# EAGLE board scooter (EAGLE 4.11)
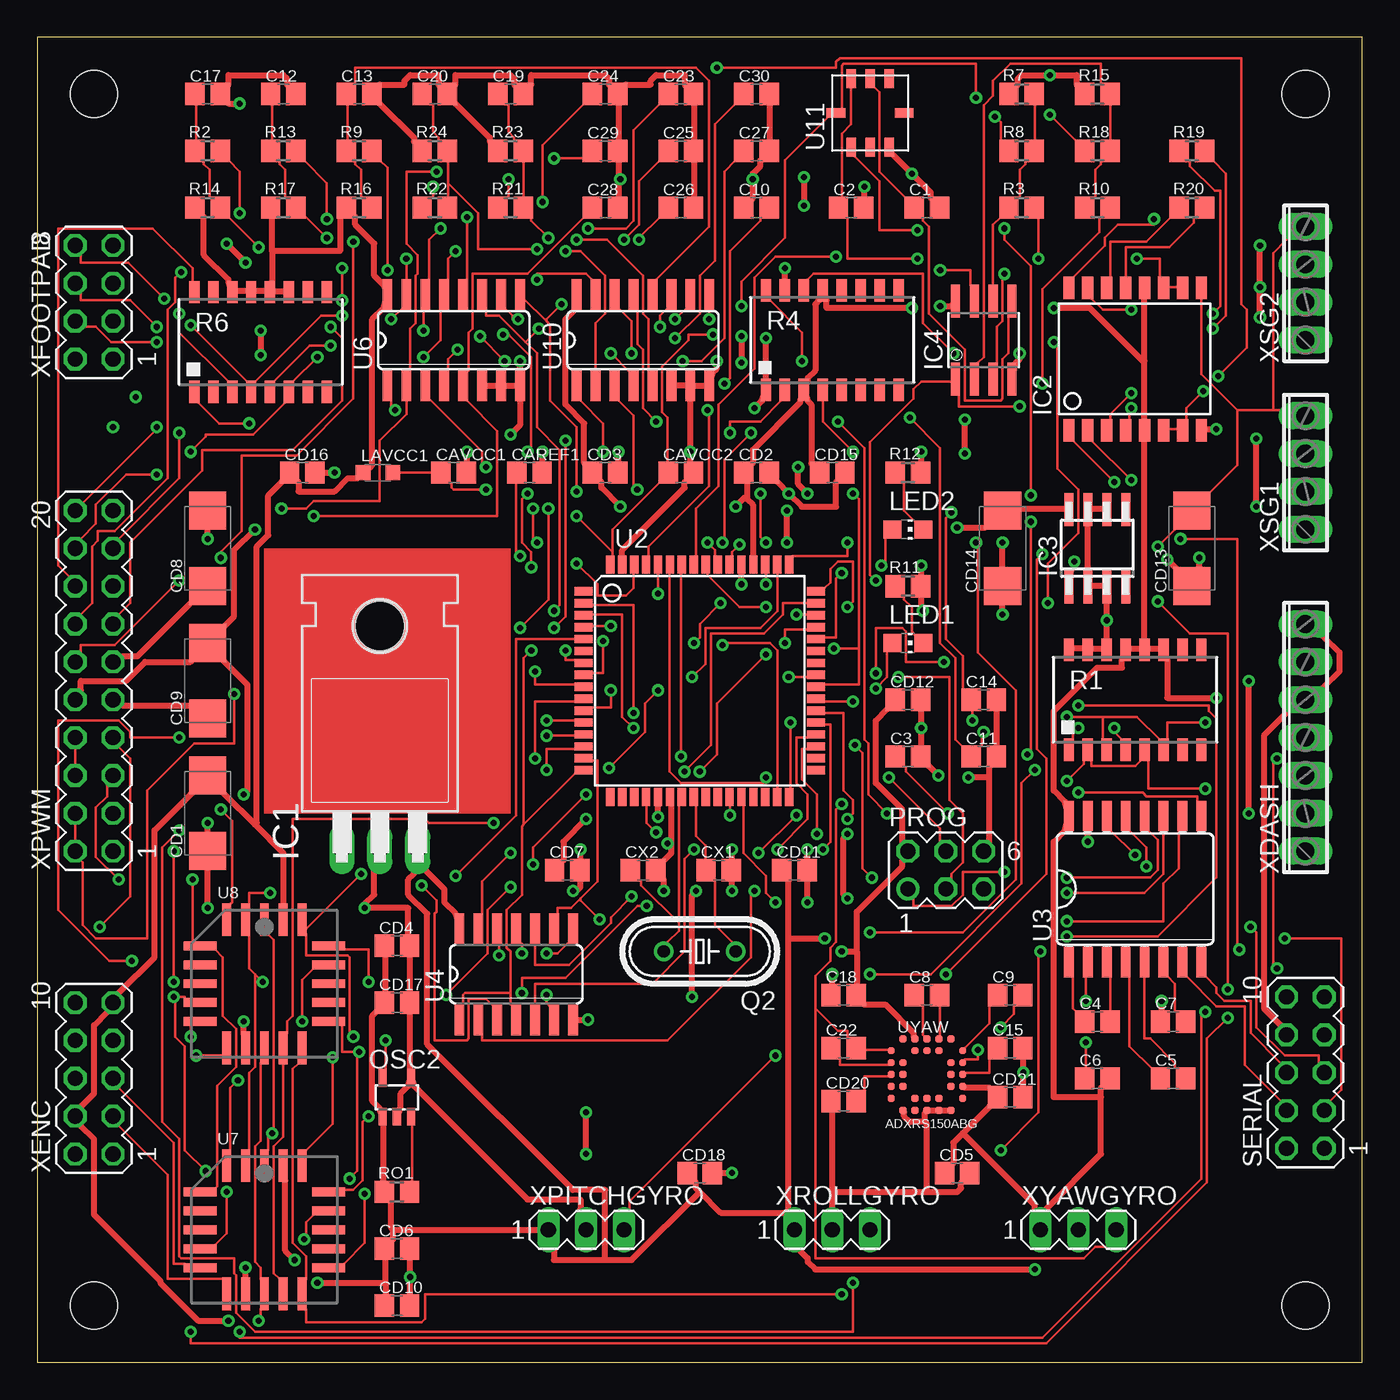
[diagram p5: board, top side]
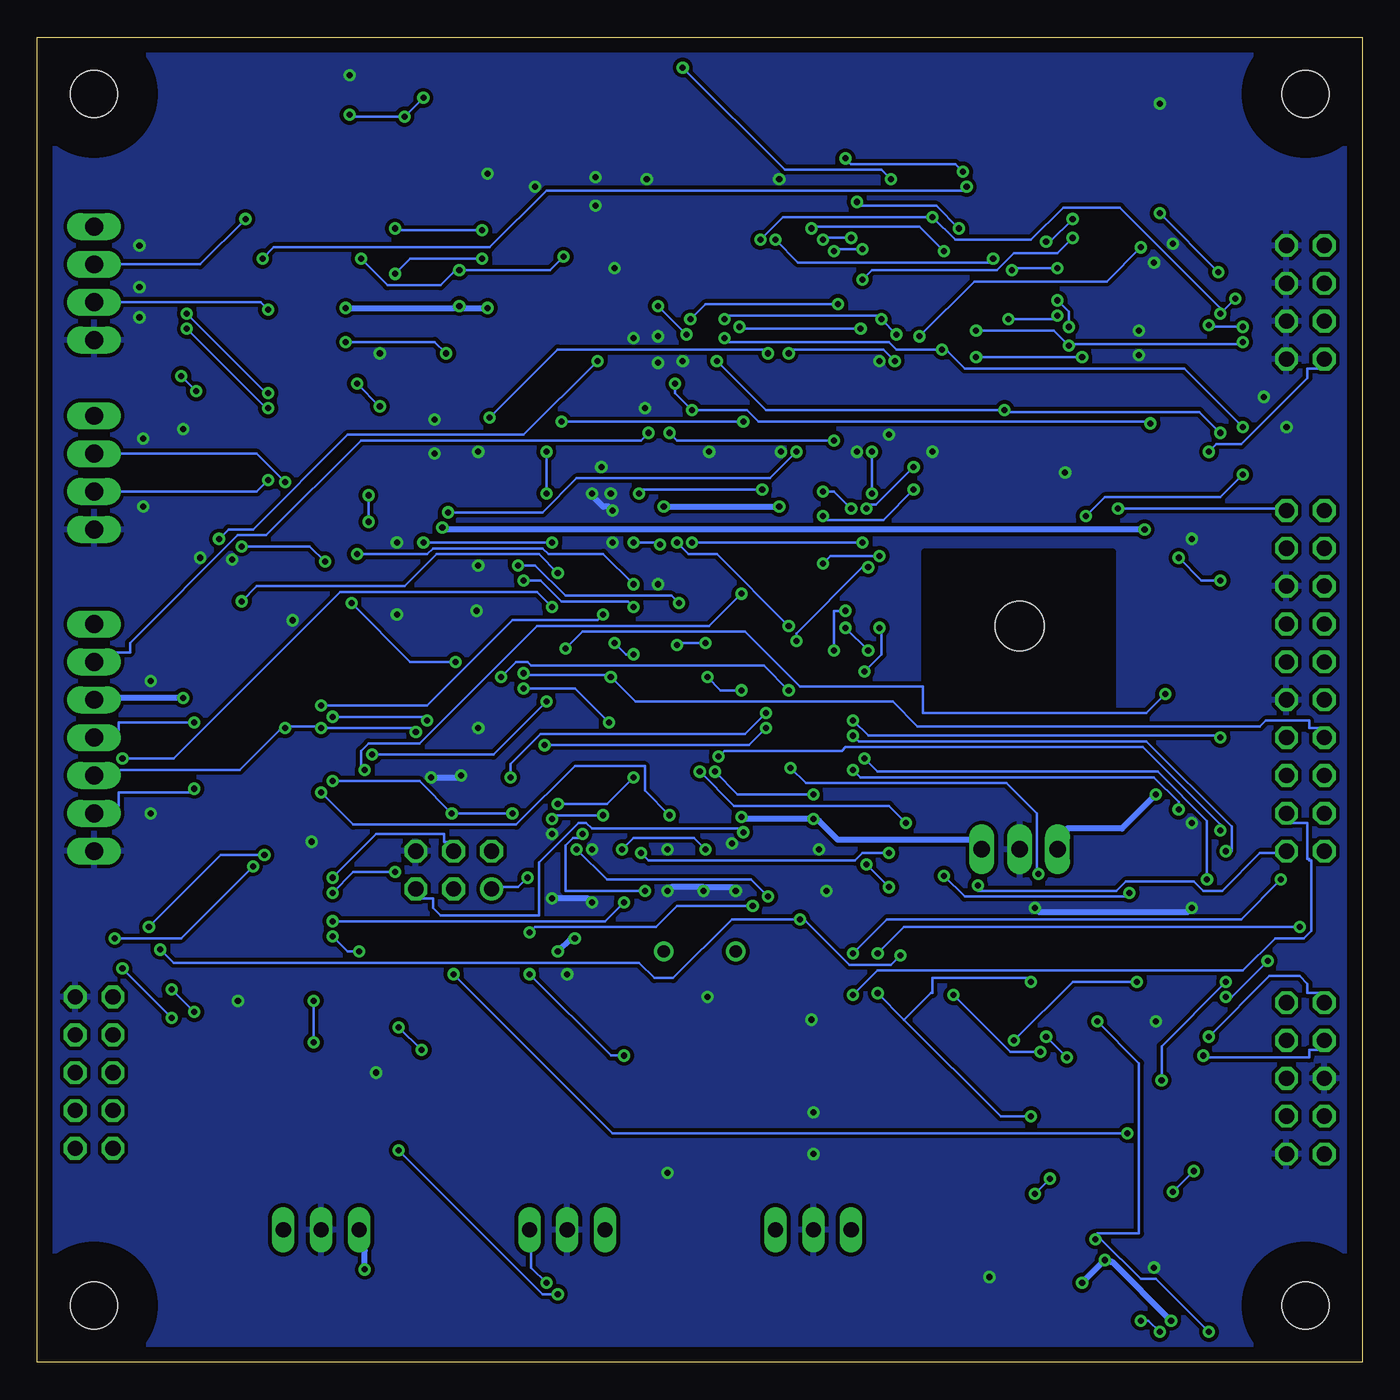
[diagram p6: board, bottom side, seen from below]

Size 88.9 x 88.9 mm. Coordinates in mm from the lower left corner, seen from the top.
Outline: 0,0 88.9,0 88.9,88.9 0,88.9 0,0
Copper layers (1*16): Top 0.035mm / dielectric 1.5mm / Bottom 0.035mm
Design rules "default": minimum track width 7mil, minimum drill 16mil, track to track 8mil, track to pad 8mil, pad to pad 8mil, via to via 8mil, smd to smd 8mil, copper to edge 40mil, drill to drill 8mil, minimum pad ring 10mil, minimum via ring 8mil, stop-mask expansion 4mil, vias tented up to drill 0mil, thermal gap 10mil
Net classes: 1 pwr: width 0.406 mm; 2 bigpwr: width 0.914 mm, clearance 0.813 mm; 3 ugpwr: width 0.61 mm, clearance 0.61 mm
Holes 3.17 mm at 3.81,85.09 85.09,3.81 3.81,3.81 85.09,85.09
tRestrict: area 0,81.3 to 7.6,88.9; area 81.3,81.3 to 88.9,88.9; area 81.3,0 to 88.9,7.6; area 0,0 to 7.6,7.6
bRestrict: area 16.8,43.7 to 29.3,54.4; area 0,81.3 to 7.6,88.9; area 81.3,81.3 to 88.9,88.9; area 81.3,0 to 88.9,7.6; area 0,0 to 7.6,7.6

## Footprints (pad centres in the part's own frame; a part is rotated, then mirrored left to right if it is on the bottom)
C0805 = smd 1.3 x 1.5: 1 -0.85,0; 2 0.85,0
C/6032-28R = smd 2.55 x 2.5: + 2.525,0; - -2.525,0
TO220H = drill 1.118 long: 1 -2.54,-10.16; 2 0,-10.16; 3 2.54,-10.16 | hole 3.302: 0,4.826
SO16-1 = smd 0.762 x 1.524: 1 -4.445,-4.775; 2 -3.175,-4.775; 3 -1.905,-4.775; 4 -0.635,-4.775; 5 0.635,-4.775; 6 1.905,-4.775; 7 3.175,-4.775; 8 4.445,-4.775; 9 4.445,4.775; 10 3.175,4.775; 11 1.905,4.775; 12 0.635,4.775; 13 -0.635,4.775; 14 -1.905,4.775; 15 -3.175,4.775; 16 -4.445,4.775
SO08 = smd 0.6 x 2.2: 1 -1.905,-2.6; 2 -0.635,-2.6; 3 0.635,-2.6; 4 1.905,-2.6; 5 1.905,2.6; 6 0.635,2.6; 7 -0.635,2.6; 8 -1.905,2.6
SO08' = smd 0.61 x 2.21: 1 -1.905,-2.616; 2 -0.635,-2.616; 3 0.635,-2.616; 4 1.905,-2.616; 5 1.905,2.616; 6 0.635,2.616; 7 -0.635,2.616; 8 -1.905,2.616
L2012C = smd 1 x 1: 1 -1,0; 2 1,0
CHIP-LED0805 = smd 1.2 x 1.2: A 0,-1.05; C 0,1.05
SOT23-5L = smd 0.55 x 1.2: 1 -0.95,-1.3; 2 0,-1.3; 3 0.95,-1.3; 4 0.95,1.3; 5 -0.95,1.3
MA03-2 = drill 1.016 round: 1 -2.54,-1.27 | drill 1.016 octagon: 2 -2.54,1.27; 3 0,-1.27; 4 0,1.27; 5 2.54,-1.27; 6 2.54,1.27
HC49/S = drill 0.813 round: 1 -2.413,0; 2 2.413,0
4816P = smd 0.7 x 1.5: 1 -4.445,-3.346; 2 -3.175,-3.346; 3 -1.905,-3.346; 4 -0.635,-3.346; 5 0.635,-3.346; 6 1.905,-3.346; 7 3.175,-3.346; 8 4.445,-3.346; 9 4.445,3.346; 10 3.175,3.346; 11 1.905,3.346; 12 0.635,3.346; 13 -0.635,3.346; 14 -1.905,3.346; 15 -3.175,3.346; 16 -4.445,3.346
R0805 = smd 1.3 x 1.5: 1 -0.85,0; 2 0.85,0
MA05-2 = drill 1.016 octagon: 1 -5.08,-1.27; 2 -5.08,1.27; 3 -2.54,-1.27; 4 -2.54,1.27; 5 0,-1.27; 6 0,1.27; 7 2.54,-1.27; 8 2.54,1.27; 9 5.08,-1.27; 10 5.08,1.27
TQFP64 = smd 1.194 x 0.559: 1 -7.8,6; 2 -7.8,5.2; 3 -7.8,4.4; 4 -7.8,3.6; 5 -7.8,2.8; 6 -7.8,2; 7 -7.8,1.2; 8 -7.8,0.4; 9 -7.8,-0.4; 10 -7.8,-1.2; 11 -7.8,-2; 12 -7.8,-2.8; 13 -7.8,-3.6; 14 -7.8,-4.4; 15 -7.8,-5.2; 16 -7.8,-6; 33 7.8,-6; 34 7.8,-5.2; 35 7.8,-4.4; 36 7.8,-3.6; 37 7.8,-2.8; 38 7.8,-2; 39 7.8,-1.2; 40 7.8,-0.4; 41 7.8,0.4; 42 7.8,1.2; 43 7.8,2; 44 7.8,2.8; 45 7.8,3.6; 46 7.8,4.4; 47 7.8,5.2; 48 7.8,6 | smd 0.559 x 1.194: 17 -6,-7.8; 18 -5.2,-7.8; 19 -4.4,-7.8; 20 -3.6,-7.8; 21 -2.8,-7.8; 22 -2,-7.8; 23 -1.2,-7.8; 24 -0.4,-7.8; 25 0.4,-7.8; 26 1.2,-7.8; 27 2,-7.8; 28 2.8,-7.8; 29 3.6,-7.8; 30 4.4,-7.8; 31 5.2,-7.8; 32 6,-7.8; 49 6,7.8; 50 5.2,7.8; 51 4.4,7.8; 52 3.6,7.8; 53 2.8,7.8; 54 2,7.8; 55 1.2,7.8; 56 0.4,7.8; 57 -0.4,7.8; 58 -1.2,7.8; 59 -2,7.8; 60 -2.8,7.8; 61 -3.6,7.8; 62 -4.4,7.8; 63 -5.2,7.8; 64 -6,7.8
SO16L = smd 0.66 x 2.032: 1 -4.445,-4.902; 2 -3.175,-4.902; 3 -1.905,-4.902; 4 -0.635,-4.902; 5 0.635,-4.902; 6 1.905,-4.902; 7 3.175,-4.902; 8 4.445,-4.902; 9 4.445,4.902; 10 3.175,4.902; 11 1.905,4.902; 12 0.635,4.902; 13 -0.635,4.902; 14 -1.905,4.902; 15 -3.175,4.902; 16 -4.445,4.902
SO14 = smd 0.66 x 2.032: 1 -3.81,-3.073; 2 -2.54,-3.073; 3 -1.27,-3.073; 4 0,-3.073; 5 1.27,-3.073; 6 2.54,-3.073; 7 3.81,-3.073; 8 3.81,3.073; 9 2.54,3.073; 10 1.27,3.073; 11 0,3.073; 12 -1.27,3.073; 13 -2.54,3.073; 14 -3.81,3.073
SO16 = smd 0.66 x 2.032: 1 -4.445,-3.073; 2 -3.175,-3.073; 3 -1.905,-3.073; 4 -0.635,-3.073; 5 0.635,-3.073; 6 1.905,-3.073; 7 3.175,-3.073; 8 4.445,-3.073; 9 4.445,3.073; 10 3.175,3.073; 11 1.905,3.073; 12 0.635,3.073; 13 -0.635,3.073; 14 -1.905,3.073; 15 -3.175,3.073; 16 -4.445,3.073
PLCC20 = smd 0.6 x 2.2: 1 0,4.3; 2 -1.27,4.3; 3 -2.54,4.3; 9 -2.54,-4.3; 10 -1.27,-4.3; 11 0,-4.3; 12 1.27,-4.3; 13 2.54,-4.3; 19 2.54,4.3; 20 1.27,4.3 | smd 2.2 x 0.6: 4 -4.3,2.54; 5 -4.3,1.27; 6 -4.3,0; 7 -4.3,-1.27; 8 -4.3,-2.54; 14 4.3,-2.54; 15 4.3,-1.27; 16 4.3,0; 17 4.3,1.27; 18 4.3,2.54
E-8 = smd 1.27 x 0.635: 1 -2.286,1.27; 2 -2.286,0; 3 -2.286,-1.27; 5 2.286,-1.27; 6 2.286,0; 7 2.286,1.27 | smd 0.635 x 1.27: 4 0,-2.286; 8 0,2.286
BC-32 = smd 0.5 x 0.5: A2 -1.6,2.4; A3 -0.8,2.4; A4 0,2.4; A5 0.8,2.4; A6 1.6,2.4; B1 -2.4,1.6; B3 -0.8,1.6; B4 0,1.6; B5 0.8,1.6; B7 2.4,1.6; C1 -2.4,0.8; C2 -1.6,0.8; C6 1.6,0.8; C7 2.4,0.8; D1 -2.4,0; D2 -1.6,0; D6 1.6,0; D7 2.4,0; E1 -2.4,-0.8; E2 -1.6,-0.8; E6 1.6,-0.8; E7 2.4,-0.8; F1 -2.4,-1.6; F3 -0.8,-1.6; F4 0,-1.6; F5 0.8,-1.6; F7 2.4,-1.6; G2 -1.6,-2.4; G3 -0.8,-2.4; G4 0,-2.4; G5 0.8,-2.4; G6 1.6,-2.4
7POL254 = drill 1.2 long: 1 -7.62,0; 2 -5.08,0; 3 -2.54,0; 4 0,0; 5 2.54,0; 6 5.08,0; 7 7.62,0
MA04-2 = drill 1.016 octagon: 1 -3.81,-1.27; 2 -3.81,1.27; 3 -1.27,-1.27; 4 -1.27,1.27; 5 1.27,-1.27; 6 1.27,1.27; 7 3.81,-1.27; 8 3.81,1.27
MA03-1 = drill 1.016 long: 1 -2.54,0; 2 0,0; 3 2.54,0
MA10-2 = drill 1.016 octagon: 1 -11.43,-1.27; 2 -11.43,1.27; 3 -8.89,-1.27; 4 -8.89,1.27; 5 -6.35,-1.27; 6 -6.35,1.27; 7 -3.81,-1.27; 8 -3.81,1.27; 9 -1.27,-1.27; 10 -1.27,1.27; 11 1.27,-1.27; 12 1.27,1.27; 13 3.81,-1.27; 14 3.81,1.27; 15 6.35,-1.27; 16 6.35,1.27; 17 8.89,-1.27; 18 8.89,1.27; 19 11.43,-1.27; 20 11.43,1.27
4POL254 = drill 1.2 long: 1 -3.81,0; 2 -1.27,0; 3 1.27,0; 4 3.81,0

## Placement (x,y rotation side)
C1  0.22uF  [C0805]  59.69,77.47 0 top
C2  0.22uF  [C0805]  54.61,77.47 0 top
C3  0.1uF  [C0805]  58.42,40.64 0 top
C4  1.0uF  [C0805]  71.12,22.86 0 top
C5  1.0uF  [C0805]  76.2,19.05 0 top
C6  1.0uF  [C0805]  71.12,19.05 0 top
C7  1.0uF  [C0805]  76.2,22.86 0 top
C8  22nF  [C0805]  59.69,24.64 0 top
C9  22nF  [C0805]  65.28,24.64 0 top
C10  0.1uF  [C0805]  48.26,77.47 0 top
C11  0.1uF  [C0805]  63.5,40.64 0 top
C12  0.1uF  [C0805]  16.51,85.09 0 top
C13  0.1uF  [C0805]  21.59,85.09 0 top
C14  0.1uF  [C0805]  63.5,44.45 0 top
C15  47nF  [C0805]  65.28,21.08 0 top
C17  0.1uF  [C0805]  11.43,85.09 0 top
C18  0.1uF  [C0805]  54.1,24.64 0 top
C19  1.0uF  [C0805]  31.75,85.09 0 top
C20  1.0uF  [C0805]  26.67,85.09 0 top
C22  10nF  [C0805]  54.1,21.08 0 top
C23  0.1uF  [C0805]  43.18,85.09 0 top
C24  0.1uF  [C0805]  38.1,85.09 0 top
C25  0.1uF  [C0805]  43.18,81.28 0 top
C26  0.1uF  [C0805]  43.18,77.47 0 top
C27  0.1uF  [C0805]  48.26,81.28 0 top
C28  0.1uF  [C0805]  38.1,77.47 0 top
C29  0.1uF  [C0805]  38.1,81.28 0 top
C30  0.1uF  [C0805]  48.26,85.09 0 top
CAREF1  0.1uF  [C0805]  33.02,59.69 0 top
CAVCC1  0.1uF  [C0805]  27.94,59.69 0 top
CAVCC2  0.1uF  [C0805]  43.18,59.69 0 top
CD1  10uF 25v  [C/6032-28R]  11.43,36.83 90 top
CD2  0.1uF  [C0805]  48.26,59.69 0 top
CD3  0.1uF  [C0805]  38.1,59.69 0 top
CD4  0.1uF  [C0805]  24.13,27.94 0 top
CD5  0.1uF  [C0805]  61.72,12.7 0 top
CD6  0.1uF  [C0805]  24.13,7.62 0 top
CD7  0.1uF  [C0805]  35.56,33.02 0 top
CD8  10uF 25v  [C/6032-28R]  11.43,54.61 90 top
CD9  10uF 25v  [C/6032-28R]  11.43,45.72 90 top
CD10  0.1uF  [C0805]  24.13,3.81 0 top
CD11  0.1uF  [C0805]  50.8,33.02 0 top
CD12  0.1uF  [C0805]  58.42,44.45 0 top
CD13  10uF 25v  [C/6032-28R]  77.47,54.61 90 top
CD14  10uF 25v  [C/6032-28R]  64.77,54.61 90 top
CD15  0.1uF  [C0805]  53.34,59.69 0 top
CD16  0.1uF  [C0805]  17.78,59.69 0 top
CD17  0.1uF  [C0805]  24.13,24.13 0 top
CD18  0.1uF  [C0805]  44.45,12.7 0 top
CD20  0.1uF  [C0805]  54.1,17.53 0 top
CD21  0.1uF  [C0805]  65.28,17.78 0 top
CX1  18p  [C0805]  45.72,33.02 0 top
CX2  18p  [C0805]  40.64,33.02 0 top
IC1  7805T  [TO220H]  22.99,44.58 0 top
IC2  INA2128U  [SO16-1]  73.66,67.31 0 top
IC3  TL750L010C  [SO08]  71.12,54.61 0 top
IC4  OPA2340U  [SO08']  63.5,68.58 0 top
LAVCC1  10uH  [L2012C]  22.86,59.69 0 top
LED1  [CHIP-LED0805]  58.42,48.26 270 top
LED2  [CHIP-LED0805]  58.42,55.88 270 top
OSC2  LTC1799S5  [SOT23-5L]  24.13,17.78 0 top
PROG  [MA03-2]  60.96,33.02 0 top
Q2  14.7  [HC49/S]  44.45,27.56 180 top
R1  10k  [4816P]  73.66,44.45 0 top
R2  10k 0.1%  [R0805]  11.43,81.28 0 top
R3  10k 0.1%  [R0805]  66.04,77.47 0 top
R4  10k  [4816P]  53.34,68.58 0 top
R6  4.7k  [4816P]  14.99,68.45 0 top
R7  10k 0.1%  [R0805]  66.04,85.09 0 top
R8  10k 0.1%  [R0805]  66.04,81.28 0 top
R9  10k 0.1%  [R0805]  21.59,81.28 0 top
R10  10k 0.1%  [R0805]  71.12,77.47 0 top
R11  1k  [R0805]  58.42,52.07 0 top
R12  1k  [R0805]  58.42,59.69 0 top
R13  10k 0.1%  [R0805]  16.51,81.28 0 top
R14  10k 0.1%  [R0805]  11.43,77.47 0 top
R15  10k 0.1%  [R0805]  71.12,85.09 0 top
R16  10k 0.1%  [R0805]  21.59,77.47 0 top
R17  10k 0.1%  [R0805]  16.51,77.47 0 top
R18  10k 0.1%  [R0805]  71.12,81.28 0 top
R19  400  [R0805]  77.47,81.28 0 top
R20  400  [R0805]  77.47,77.47 0 top
R21  10k 0.1%  [R0805]  31.75,77.47 0 top
R22  10k 0.1%  [R0805]  26.67,77.47 0 top
R23  10k 0.1%  [R0805]  31.75,81.28 0 top
R24  10k 0.1%  [R0805]  26.67,81.28 0 top
RO1  10k 1%  [R0805]  24.13,11.43 0 top
SERIAL  [MA05-2]  85.09,19.43 90 top
U2  MEGA128-A  [TQFP64]  44.45,45.72 0 top
U3  MAX232ECWE  [SO16L]  73.66,31.75 0 top
U4  74HC08D  [SO14]  32.13,26.04 0 top
U6  4051D  [SO16]  27.94,68.58 0 top
U7  HCTL-2016#PLC  [PLCC20]  15.24,8.89 0 top
U8  HCTL-2016#PLC  [PLCC20]  15.24,25.4 0 top
U10  4051D  [SO16]  40.64,68.58 0 top
U11  ADXL311JE  [E-8]  55.88,83.82 90 top
UYAW  ADXRS150ABG  [BC-32]  59.69,19.3 0 top
XDASH  [7POL254]  85.09,41.91 90 top
XENC  [MA05-2]  3.81,19.05 90 top
XFOOTPAD  [MA04-2]  3.81,71.12 90 top
XPITCHGYRO  [MA03-1]  36.83,8.89 0 top
XPWM  [MA10-2]  3.81,45.72 90 top
XROLLGYRO  [MA03-1]  53.34,8.89 0 top
XSG1  [4POL254]  85.09,59.69 90 top
XSG2  [4POL254]  85.09,72.39 90 top
XYAWGYRO  [MA03-1]  69.85,8.89 0 top

## Tracks (layer width: path | path; a pad name or v marks a point on that pad's centre or on a via)
+15V  (via drill 0.41)
  Top 0.406: IC3.8 68.96,57.28 65.91,57.28 CD14.+ 63.63,56.01 v61.72,56.01 | CD9.+ 10.29,46.99 7.24,46.99 5.97,45.72 2.92,45.72 2.92,45.09 XPWM.10 | v13.84,38.1 14.1,38.35 14.1,45.47 12.57,46.99 CD9.+ | v14.61,55.88 13.21,54.48 13.21,50.04 12.57,49.4 CD9.+
  Bottom 0.406: v13.84,38.1 16.13,35.81 19.81,35.81 19.81,35.69 IC1.1 | v61.72,56.01 61.59,55.88 v14.61,55.88
-15V
  Top 0.406: CD8.- 10.29,50.93 6.73,47.37 5.71,47.37 XPWM.11
/RESET  (via drill 0.41)
  Top 0.178: v41.53,35.56 40.89,36.2 40.89,37.34 U2.20
  Bottom 0.178: v41.53,35.56 41.78,35.81 51.69,35.81 52.07,36.2 52.58,36.2 55.24,33.53 55.24,29.97 61.85,29.97 62.36,30.48 62.36,31.11 63.12,31.11 PROG.5
ACCEL_ST  (via drill 0.41)
  Top 0.178: v54.74,44.32 52.83,44.32 U2.39 | v66.42,40.77 66.67,41.02 v66.67,56.39 | v66.67,58.17 66.67,73.53 64.9,75.31 v64.9,76.07 | v59.05,75.95 56.52,75.95 56.52,79.25 54.86,80.9 54.86,81.03 U11.1
  Bottom 0.178: v54.74,44.32 58.29,40.77 v66.42,40.77 | v66.67,56.39 v66.67,58.17 | v64.9,76.07 64.77,75.95 v59.05,75.95
ADCMUX1  (via drill 0.41)
  Top 0.178: v47.12,54.86 46.61,54.36 46.61,54.1 U2.54 | v48.9,54.99 48.51,55.37 v48.51,58.29 | v40.26,58.55 40.01,58.8 40.01,63.5 38.99,64.52 U10.3
  Bottom 0.178: v47.12,54.86 47.24,54.99 v48.9,54.99 | v48.51,58.29 48.26,58.55 v40.26,58.55
ADCMUX2  (via drill 0.41)
  Top 0.178: v44.96,54.99 45.47,54.48 45.47,54.1 U2.55 | v33.53,54.99 33.27,55.24 v33.27,57.28 | v30.1,60.07 29.84,60.33 29.84,61.09 26.29,64.64 U6.3
  Bottom 0.178: v33.53,54.99 v44.96,54.99 | v33.27,57.28 33.02,57.53 32.64,57.53 v30.1,60.07
AREF  (via drill 0.41)
  Top 0.178: v36.2,53.59 37.59,52.2 37.59,51.44 39.5,51.44 40.01,51.94 40.01,52.96 U2.62 | v32.38,54.1 32.13,54.36 32.13,59.05 CAREF1.1
  Bottom 0.178: v36.2,53.59 35.69,54.1 v32.38,54.1
AVCC1  (via drill 0.41)
  Top 0.178: v62.99,84.84 62.99,87.12 54.1,87.12 53.98,87 53.98,84.07 U11.8 53.09,83.57 50.16,80.64 50.16,75.44 47.24,72.52 v47.24,70.87 | v64.26,83.57 64.64,83.19 64.64,81.92 R8.1 | v67.94,83.69 69.72,81.92 R18.1 | LAVCC1.2 CAVCC1.1 27.69,59.05 27.81,58.93 27.81,58.67 27.94,58.55 v30.1,58.55 | 38.61,54.36 38.61,55.88 41.78,59.05 CAVCC2.1 42.29,60.33 42.29,63.37 41.91,63.75 41.91,66.8 43.69,68.58 43.69,68.96 v45.34,68.96 | 38.61,54.36 38.61,54.1 U2.64 | v36.2,56.77 38.61,54.36
  Bottom 0.178: v62.99,84.84 v64.26,83.57 67.82,83.57 v67.94,83.69 | v30.1,58.55 32.13,56.52 35.94,56.52 v36.2,56.77 | v45.34,68.96 v47.24,70.87
BAT_VOLTAGE  (via drill 0.41)
  Top 0.178: v44.96,63.88 45.09,63.75 45.09,58.8 41.02,54.74 41.02,54.1 U2.61 | v46.1,65.66 46.48,66.04 46.48,74.55 48.51,76.58 48.51,76.83 C10.2 | v14.22,62.99 12.19,62.99 10.79,64.39 R6.1
  Bottom 0.178: v46.1,65.66 46.1,65.02 v44.96,63.88 41.27,63.88 40.51,63.12 14.35,63.12 v14.22,62.99
BATIS  (via drill 0.41)
  Top 0.178: C17.1 10.67,84.45 10.67,81.92 R2.1 11.18,80.64 11.18,80.39 11.56,80.01 11.56,78.23 11.68,78.11 R14.2 12.83,76.83 v14.86,74.8 | v38.48,67.69 39.75,66.42 U10.4 | v29.72,68.83 v31.37,67.18
  Bottom 0.178: v38.48,67.69 38.23,67.94 32.13,67.94 v31.37,67.18 | v29.72,68.83 26.04,72.52 17.14,72.52 v14.86,74.8
BATISIN  (via drill 0.41)
  Top 0.178: v13.59,77.09 13.59,79.88 12.83,80.64 R2.2 | v9.65,73.15 9.27,72.77 9.27,71.12 8.76,70.61 8.76,59.31 5.21,55.75 4.06,55.75 4.06,55.12 3.68,54.74 3.68,50.93 2.92,50.16 XPWM.14
  Bottom 0.178: v9.65,73.15 v13.59,77.09
BEEPER  (via drill 0.41)
  Top 0.178: v38.48,49.4 37.21,49.4 U2.4 | v45.97,54.99 46.1,55.12 46.1,60.58 v47.88,62.36
  Bottom 0.178: v38.48,49.4 43.31,54.23 45.21,54.23 v45.97,54.99 | v47.88,62.36 48.39,61.85 67.18,61.85 73.53,55.5 75.44,55.5 82.68,48.26 82.68,47.62 83.57,47.62 XDASH.6
D0  (via drill 0.41)
  Top 0.178: v48.9,52.2 48.9,52.96 U2.51 | v67.44,54.23 67.06,53.85 67.06,41.15 67.69,40.51 67.69,32.77 v60.96,26.04 | U7.1 15.49,14.22 15.49,15.11 v15.75,15.37 15.88,15.75 15.88,28.32 15.49,28.7 U8.1
  Bottom 0.178: v48.9,52.2 50.93,54.23 54.61,54.23 54.99,54.61 62.36,54.61 62.74,54.23 v67.44,54.23 | v60.96,26.04 50.29,15.37 v15.75,15.37
D1  (via drill 0.41)
  Top 0.178: v43.94,45.97 44.83,46.86 44.83,49.28 48.51,49.28 49.66,50.42 49.66,52.96 U2.50 | v41.66,45.09 40.77,44.2 40.77,42.29 v38.35,39.88 | v21.72,32.77 18.03,29.08 U8.19 18.03,28.7 18.03,27.3 20.83,27.3 20.95,27.18 20.95,22.1 v21.21,21.84 | v19.81,20.45 19.81,16 18.03,14.22 U7.19
  Bottom 0.178: v43.94,45.97 43.05,45.09 v41.66,45.09 | v38.35,39.88 37.34,38.86 23.88,38.86 21.84,36.83 21.84,32.77 v21.72,32.77 | v19.81,20.45 v21.21,21.84
D2  (via drill 0.41)
  Top 0.178: v54.36,54.99 54.36,54.1 50.67,54.1 U2.49 | v62.99,54.99 63.12,54.86 63.12,47.62 65.66,45.09 65.66,32.38 62.1,28.83 v55.88,28.83 | v40.89,30.61 40.26,30.61 35.43,25.78 32.51,25.78 v32.51,24.77 | v22.23,16.51 21.84,16.13 21.84,12.19 21.21,11.56 20.57,11.56 U7.18 | v22.23,25.53 22.23,27.69 20.57,27.69 U8.18
  Bottom 0.178: v62.99,54.99 v54.36,54.99 | v55.88,28.83 55.5,29.21 47.37,29.21 45.97,30.61 v40.89,30.61 | 30.73,22.99 24.26,16.51 v22.23,16.51 | 30.73,22.99 v32.51,24.77 | v22.23,25.53 22.23,25.78 28.83,25.78 28.83,24.77 28.96,24.77 30.73,22.99
D3  (via drill 0.41)
  Top 0.178: v54.36,50.67 54.74,51.05 54.74,53.72 53.72,53.72 53.21,53.21 53.21,52.32 52.83,51.94 U2.48 | v83.19,40.51 82.93,40.26 82.93,26.67 v83.19,26.42 | v79.88,23.11 78.49,21.72 78.49,12.06 67.69,1.27 10.29,1.27 v10.29,2.03 | v17.91,8.26 18.03,8.38 18.03,9.4 18.54,9.91 U7.17 | v17.78,22.86 17.78,25.65 18.54,26.42 U8.17
  Bottom 0.178: v54.36,50.67 55.37,51.69 68.58,51.69 79.76,40.51 v83.19,40.51 | v79.88,23.11 v83.19,26.42 | v10.29,2.03 13.84,5.59 14.86,5.59 17.53,8.26 v17.91,8.26 17.78,8.64 14.99,8.64 14.99,20.07 v17.78,22.86
D4  (via drill 0.41)
  Top 0.178: v43.43,39.62 45.21,41.4 45.21,48.9 48.77,48.9 50.04,50.16 50.04,50.93 51.69,50.93 U2.47 | v36.83,38.1 33.27,34.54 v33.27,33.4 | v31.75,31.88 30.23,30.35 30.23,27.43 v27.43,24.64 | U8.14 20.45,22.61 20.45,20.83 v21.59,20.83 21.46,20.45 21.46,12.83 v20.95,12.32 | v21.97,11.3 21.97,8 20.57,6.6 U7.14
  Bottom 0.178: v43.43,39.62 41.91,38.1 v36.83,38.1 | v31.75,31.88 v33.27,33.4 | v27.43,24.64 23.62,20.83 v21.59,20.83 | v21.97,11.3 v20.95,12.32
D5  (via drill 0.41)
  Top 0.178: v50.93,50.16 51.69,50.16 U2.46 | v69.85,44.07 78.61,44.07 78.61,43.69 79.12,43.18 79.12,32.51 75.18,28.57 v69.09,28.57 | v67.31,27.56 67.18,27.43 67.18,16.76 v64.64,14.22 | v53.98,4.57 26.04,4.57 26.04,2.92 25.78,2.67 18.03,2.67 18.03,3.56 U7.13 18.03,5.59 18.03,7.11 17.14,8 17.14,19.68 17.53,20.07 U8.13
  Bottom 0.178: v50.93,50.16 51.31,49.78 57.02,49.78 62.74,44.07 v69.85,44.07 | v69.09,28.57 68.07,27.56 v67.31,27.56 | v64.64,14.22 54.99,4.57 v53.98,4.57
D6  (via drill 0.41)
  Top 0.178: v50.16,48.26 50.16,49.15 51.69,49.15 U2.45 | v48.9,47.5 45.59,44.2 45.59,40.77 v44.45,39.62 | v30.61,36.2 26.29,36.2 26.04,36.45 17.14,36.45 17.14,23.24 16.76,22.86 16.76,22.1 U8.12 16.51,15.11 15.88,14.48 15.88,5.97 16.26,5.59 U7.12
  Bottom 0.178: v50.16,48.26 49.4,47.5 v48.9,47.5 | v44.45,39.62 42.16,37.34 31.75,37.34 v30.61,36.2
D7  (via drill 0.41)
  Top 0.178: v53.98,52.96 53.59,52.58 53.59,48.64 52.83,48.64 U2.44 | v75.18,51.05 77.34,48.9 79.88,48.9 v79.88,25.02 | v78.36,23.5 78.11,23.24 78.11,12.32 67.44,1.65 13.59,1.65 v13.59,2.03 | v14.86,2.79 14.99,2.92 14.99,3.56 U7.11 14.99,5.59 14.99,6.35 14.61,6.73 14.61,14.48 14.99,14.86 14.99,20.07 U8.11
  Bottom 0.178: v53.98,52.96 55.24,54.23 62.1,54.23 64.26,52.07 74.17,52.07 v75.18,51.05 | v78.36,23.5 v79.88,25.02 | v13.59,2.03 14.35,2.79 v14.86,2.79
ENC1A
  Top 0.178: U7.9 12.45,5.59 8.76,5.59 8.76,12.57 5.46,15.88 XENC.3
ENC1B
  Top 0.178: U7.8 9.91,6.6 9.14,6.6 9.14,14.73 5.46,18.41 XENC.5
ENC2A  (via drill 0.41)
  Top 0.178: v10.67,20.57 12.45,20.57 U8.9
  Bottom 0.178: v10.67,20.57 10.54,20.45 3.56,20.45 3.56,20.95 2.92,20.95 XENC.8
ENC2B  (via drill 0.41)
  Top 0.178: v10.29,21.84 10.29,22.61 U8.8
  Bottom 0.178: v10.29,21.84 6.22,25.91 4.19,25.91 3.68,25.4 3.68,24.77 2.92,24.77 XENC.10
ENCCLK  (via drill 0.41)
  Top 0.178: v28.07,32.64 32.13,36.7 32.13,48.51 36.07,48.51 U2.5 | v15.62,31.5 14.22,31.5 14.22,30.73 U8.2 14.22,28.7 14.22,26.42 14.61,26.04 | v23.37,21.59 23.37,19.56 OSC2.5 | 14.61,26.04 v15.11,25.53 | 14.61,26.04 14.61,19.81 14.22,19.43 14.22,14.22 U7.2
  Bottom 0.178: v28.07,32.64 26.67,31.24 15.88,31.24 v15.62,31.5 | v23.37,21.59 19.43,25.53 v15.11,25.53
EXTRAMUX0  (via drill 0.41)
  Top 0.178: v35.43,47.75 35.43,47.12 36.07,47.12 U2.7 | v34.67,50.42 35.05,50.8 35.05,61.21 33.53,62.74 33.53,67.69 32.77,68.45 | 32.77,68.45 30.99,70.23 30.1,70.23 30.1,70.74 U6.11 | v41.78,69.47 41.78,70.23 42.29,70.74 U10.11 | 32.77,68.45 v33.66,69.34
  Bottom 0.178: v35.43,47.75 35.43,50.42 v34.67,50.42 | v41.78,69.47 41.66,69.34 v33.66,69.34
EXTRAMUX1  (via drill 0.41)
  Top 0.178: v37.97,48.39 37.97,46.23 37.21,46.23 U2.8 | v33.15,53.34 33.15,54.36 32.51,54.99 32.51,57.91 v32.89,58.29 | v32.89,61.09 33.15,61.34 33.15,67.44 31.62,68.96 v31.24,68.96 | v32.26,69.98 31.88,69.98 31.88,70.23 31.37,70.74 U6.10 | v42.8,69.98 43.56,70.74 U10.10
  Bottom 0.178: v37.97,48.39 37.97,48.9 33.53,53.34 v33.15,53.34 | v32.89,58.29 v32.89,61.09 | v31.24,68.96 v32.26,69.98 32.51,70.23 42.55,70.23 v42.8,69.98
EXTRAMUX2  (via drill 0.41)
  Top 0.178: v33.4,46.35 33.4,45.47 36.07,45.47 U2.9 | v32.38,49.28 34.29,51.18 v34.29,57.28 | v36.2,58.42 36.2,62.74 34.42,64.52 34.42,69.6 34.16,69.85 | 34.16,69.85 32.64,71.37 U6.9 | v35.18,70.99 34.16,69.98 34.16,69.85 | v45.09,69.98 U10.9
  Bottom 0.178: v33.4,46.35 32.26,47.5 32.26,49.28 v32.38,49.28 | v34.29,57.28 35.43,58.42 v36.2,58.42 | v45.09,69.98 44.07,70.99 v35.18,70.99
FWD_ACCEL  (via drill 0.41)
  Top 0.178: v48.9,50.67 47.12,50.67 44.96,52.83 44.96,52.96 U2.56 | v56.26,52.45 55.88,52.83 55.88,61.72 58.8,64.64 58.8,65.28 59.31,65.79 61.34,65.79 IC4.1 61.85,64.9 61.85,64.14 v65.91,64.14 | v67.44,65.66 67.44,72.01 71.25,75.82 71.25,76.71 71.37,76.83 R10.2
  Bottom 0.178: v48.9,50.67 49.28,51.05 53.72,51.05 55.12,52.45 v56.26,52.45 | v65.91,64.14 v67.44,65.66
GND  (via drill 0.41)
  Top 0.406: 38.99,79.38 38.99,80.64 C29.2 38.99,81.92 38.99,84.45 C24.2 | 38.99,79.38 38.99,78.11 C28.2 | C26.2 44.07,78.11 44.07,80.64 C25.2 44.07,81.92 44.07,84.45 C23.2 43.43,85.72 43.43,86.36 41.53,86.36 41.15,85.98 41.15,85.72 39.5,85.72 C24.2 | R24.1 25.27,81.92 25.27,82.17 22.99,84.45 C13.2 22.99,85.72 24.64,85.72 24.64,85.98 25.02,86.36 26.92,86.36 26.92,85.72 C20.2 | C20.2 28.07,84.45 30.35,82.17 30.35,81.92 R23.1 | C20.2 28.07,85.72 28.07,86.36 31.75,86.36 32,86.11 32,85.72 C19.2 33.15,85.72 33.15,86.36 38.1,86.36 38.35,86.11 38.35,85.72 C24.2 | U10.6 42.8,65.53 43.56,65.53 U10.7 | U10.7 44.07,65.53 44.83,65.53 U10.8 45.34,66.42 45.59,66.67 v45.59,67.18 | U2.63 39.24,54.1 39.24,54.48 43.43,58.67 43.43,59.05 CAVCC2.2 43.81,60.33 v43.81,61.09 U10.7 | IC3.6 71.5,57.28 70.74,57.28 IC3.7 IC3.2 70.74,52.07 71.5,52.07 IC3.3 v71.75,49.78 R1.14 71.5,47.88 70.74,47.88 R1.15 70.23,47.88 69.47,47.88 R1.16 | OSC2.2 24.38,17.02 24.38,18.03 24.89,18.54 OSC2.4 | OSC2.4 25.02,19.56 25.02,23.5 CD17.2 25.02,24.77 25.02,27.3 CD4.2 24.89,27.94 24.89,30.48 v21.97,30.48 21.97,30.73 22.61,31.37 22.61,32.89 IC1.2 | C10.1 48.01,78.11 v48.01,79.38 48.01,79.76 48.51,80.26 48.51,80.64 C27.2 49.15,81.92 49.15,84.45 C30.2 | UYAW.G6 61.09,16.89 60.71,16.89 UYAW.G5 60.33,16.89 59.82,16.89 UYAW.G4 59.56,16.76 59.56,16.13 | 59.56,16.13 58.55,16.13 58.17,16.51 58.17,16.76 UYAW.G2 | 59.69,11.43 61.72,11.43 61.98,11.68 61.98,12.06 CD5.2 | 59.69,11.43 59.69,16 59.56,16.13 | U11.3 57.4,81.03 v58.67,79.76 59.94,78.49 59.94,78.11 C1.2 | CD2.2 49.66,59.05 v50.42,58.29 51.31,57.4 53.59,57.4 53.59,59.05 CD15.2
  Top 0.406: R7.1 65.79,85.72 65.79,86.11 66.04,86.36 v67.94,86.36 69.72,86.36 69.72,85.72 R15.1 | 42.55,34.8 42.55,34.16 42.04,33.66 CX2.2 42.04,32.38 v42.04,31.62 | 42.55,34.8 42.55,37.34 U2.22 | U6.6 30.1,65.53 30.86,65.53 U6.7 31.37,65.53 32.13,65.53 U6.8 | C14.2 64.39,43.81 64.39,41.27 C11.2 63.88,40.01 63.88,39.24 | CD12.2 59.31,43.81 v59.31,42.55 59.31,41.27 C3.2 59.82,40.01 v60.45,39.37 | CD10.2 25.02,4.45 v25.02,5.71 25.02,6.99 CD6.2 | CD21.2 66.17,18.41 v66.17,19.43 66.17,20.45 C15.2 | v47.24,52.2 47.24,52.96 U2.53 | v13.59,84.45 12.83,84.45 C17.2 12.83,85.72 12.83,86.36 16.51,86.36 16.76,86.11 16.76,85.72 C12.2 | CD18.2 v46.61,12.7 | v36.45,34.42 36.45,33.66 CD7.2 36.45,32.38 36.45,31.88 36.2,31.62 v35.94,31.62 | 53.34,11.43 53.34,16.89 CD20.1 | XROLLGYRO.2 53.34,11.43 | v53.34,26.04 53.34,25.27 C18.1 | CD16.2 v19.94,59.69 | v46.61,34.42 46.61,33.66 CX1.2 46.61,32.38 v46.61,31.62 | v51.69,34.42 51.69,33.66 CD11.2 51.69,32.38 v51.69,30.86 | v28.83,61.09 28.83,60.33 CAVCC1.2 | v33.91,61.09 33.91,60.33 CAREF1.2 | v75.44,24.26 75.44,23.5 C7.1 | v38.99,61.09 38.99,60.33 CD3.2 | v59.31,53.47 59.31,52.7 R11.2 59.31,51.44 59.31,50.42 v59.44,50.42 | v48.13,64.01 48.64,64.52 R4.1 v48.9,68.71 | v59.31,61.09 59.31,60.33 R12.2 | R4.15 v50.16,73.41 | v55.5,78.87 55.5,78.11 C2.2 | v79.12,62.61 78.36,62.61 IC2.8 | v36.96,22.99 36.2,22.99 U4.7 | v70.48,34.92 U3.15 | U7.10 v13.97,6.35 | v13.84,22.86 13.84,22.1 U8.10 | v65.91,67.69 65.91,67.31 65.66,67.06 IC4.4 | v11.43,36.2 CD1.- v11.43,30.48 | CD9.- 10.29,44.07 5.71,44.07 XPWM.9 | v11.43,55.24 CD8.+ | v64.77,50.16 CD14.- v64.77,54.99 | v77.98,53.98 77.98,53.34 CD13.- 76.33,53.34 v75.82,53.85
  Top 0.406: 63.88,39.24 63.88,34.92 PROG.6 | U6.8 v32.38,67.18 | 42.55,34.8 v42.29,34.8 | 53.34,11.43 59.69,11.43 | OSC2.4 25.27,18.54 32.89,10.92 36.45,10.92 36.45,10.29 XPITCHGYRO.2 | 38.99,79.38 v39.12,79.38 | v50.29,54.99 v50.29,57.15 | v51.69,58.29 51.05,58.93 v51.05,60.07 | v44.2,31.62 43.94,31.37 v43.94,24.51 | v54.36,31.11 54.1,31.37 54.1,35.18 v54.36,35.43 | U6.8 32.38,62.87 v31.75,62.23 | 63.88,39.24 v62.48,39.24 | v36.83,13.97 v36.83,16.76 | v62.23,60.96 v62.23,63.25 | v81.79,57.4 v81.79,61.98 | v82.04,70.1 v82.04,72.14 v82.04,74.93 | v81.28,36.83 v81.28,45.72 | v12.7,75.06 v13.97,73.79 | v14.99,69.22 v14.99,67.56 | v47.24,68.83 v47.24,67.06 | v51.44,79.5 v51.44,77.6
  Bottom 0.406: v21.97,30.48 21.72,30.23 11.68,30.23 v11.43,30.48 | v50.29,57.15 50.55,57.4 50.93,57.4 51.69,58.17 v51.69,58.29 | v42.04,31.62 42.29,31.88 44.2,31.88 | 44.2,31.88 46.35,31.88 v46.61,31.62 | v44.2,31.62 44.2,31.88 | v51.69,30.86 51.94,31.11 v54.36,31.11 | v60.45,39.37 60.58,39.24 v62.48,39.24
  other vias: 6.6,64.77 5.08,62.74
  pour Bottom (isolate 0.254): 0,88.9 88.9,88.9 88.9,0 0,0
KNOB1  (via drill 0.41)
  Top 0.178: v61.09,36.83 58.29,39.62 58.29,39.88 58.17,40.01 C3.1 | v69.09,38.99 70.23,40.13 70.23,40.39 R1.2 70.74,40.39 70.74,40.01 73.66,40.01 74.04,40.39 R1.5 74.55,40.39 74.55,38.48 v78.36,38.48 | v41.53,63.12 40.64,64.01 40.64,67.94 40.26,68.33 40.26,70.74 U10.13 | v53.72,63.12 55.5,61.34 55.5,41.78 55.75,41.53 55.75,38.1 v57.02,36.83
  Bottom 0.178: v69.09,38.99 63.25,38.99 v61.09,36.83 v57.02,36.83 | v53.72,63.12 v41.53,63.12 | v78.36,38.48 78.61,38.23 83.44,38.23 83.44,37.34 XDASH.2
KNOB2  (via drill 0.41)
  Top 0.178: v63.5,42.29 63.37,42.16 63.37,41.4 63.25,41.27 C11.1 62.1,41.27 61.59,41.78 61.59,47.24 60.58,48.26 60.58,61.34 v58.55,63.37 | v69.85,42.55 69.47,42.16 69.47,41.78 R1.1 | v72.26,42.55 72.26,42.29 72.77,41.78 R1.4 | v39.88,67.69 39.88,69.85 38.99,70.74 U10.14
  Bottom 0.178: v63.5,42.29 63.75,42.55 v69.85,42.55 70.23,42.67 72.14,42.67 v72.26,42.55 72.64,42.42 75.31,39.75 83.31,39.75 XDASH.3 | v39.88,67.69 40.13,67.94 53.98,67.94 v58.55,63.37
KNOB3  (via drill 0.41)
  Top 0.178: v62.74,43.05 62.74,43.81 C14.1 62.1,45.09 62.1,47.37 60.96,48.51 60.96,56.64 v61.34,57.02 | v69.09,43.31 71.5,43.31 | 71.5,43.31 71.5,41.78 R1.3 | 71.5,43.31 73.79,43.31 75.31,41.78 R1.6 75.82,41.78 75.82,42.93 v78.36,42.93 | v37.97,61.09 37.97,62.99 36.45,64.52 U10.1
  Bottom 0.178: v62.74,43.05 62.99,43.31 v69.09,43.31 | v37.97,61.09 39.75,59.31 52.7,59.31 54.99,57.02 v61.34,57.02 | v78.36,42.93 83.44,42.93 83.44,42.42 XDASH.4
L_PWM_ENABLE  (via drill 0.41)
  Top 0.178: XPWM.4 XPWM.2 2.92,33.66 3.05,33.53 3.05,29.34 3.94,28.45 7.37,28.45 7.37,38.35 10.54,41.53 13.21,41.53 v13.21,44.83 | 55.12,47.88 55.12,57.91 v54.74,58.29 | 55.12,47.88 55.12,45.47 52.83,45.47 U2.40 | v54.74,61.09 52.7,63.12 R4.4 | v53.47,47.88 55.12,47.88
  Bottom 0.178: v54.74,58.29 v54.74,61.09 | v13.21,44.83 14.48,43.56 29.46,43.56 29.46,45.34 37.72,45.34 41.4,49.02 52.32,49.02 v53.47,47.88
L_PWM_FWD  (via drill 0.41)
  Top 0.178: v52.32,35.43 52.32,38.1 51.31,39.12 51.31,41.15 51.69,41.15 U2.35 | v48.13,31.62 47.88,31.37 47.88,27.18 42.29,21.59 29.84,21.59 29.84,21.97 U4.2
  Bottom 0.178: v52.32,35.43 52.58,35.18 52.96,35.18 53.47,34.67 53.47,31.62 v48.13,31.62
L_PWM_REV  (via drill 0.41)
  Top 0.178: v49.66,34.42 51.69,36.45 51.69,38.1 50.93,38.86 50.93,41.91 51.69,41.91 U2.36 | v44.07,34.42 43.43,33.78 43.43,27.56 41.27,25.4 33.4,25.4 U4.5
  Bottom 0.178: v49.66,34.42 48.9,35.18 44.83,35.18 v44.07,34.42
LED1  (via drill 0.41)
  Top 0.178: v50.55,42.93 50.55,38.48 U2.32 | v56.26,45.21 57.02,45.97 57.02,47.75 LED1.A
  Bottom 0.178: v50.55,42.93 52.83,45.21 v56.26,45.21
LED2  (via drill 0.41)
  Top 0.178: v45.97,48.13 45.97,48.26 49.15,48.26 49.66,47.75 49.66,38.48 U2.31 | v44.07,48.26 44.45,48.64 44.45,49.53 v45.85,50.93 | v56.64,53.47 56.9,53.72 56.9,55.37 LED2.A
  Bottom 0.178: v45.97,48.13 45.85,48.26 v44.07,48.26 | v45.85,50.93 46.35,51.44 53.47,51.44 55.5,53.47 v56.64,53.47
LFOOTPAD1  (via drill 0.41)
  Top 0.178: v10.29,61.09 11.3,62.1 11.3,62.23 14.48,62.23 16.64,64.39 R6.6 17.14,65.79 v18.8,67.44 | v36.96,76.07 39.5,76.07 40.01,76.58 40.01,82.68 41.78,84.45 C23.1 | v28.07,74.55 27.56,74.04 27.56,72.64 U6.13 27.05,70.74 27.05,68.58 v25.91,67.44
  Bottom 0.178: v10.29,61.09 9.78,61.59 8.13,61.59 3.68,66.04 3.68,66.67 2.92,66.67 XFOOTPAD.2 | v36.96,76.07 36.83,76.2 29.72,76.2 v28.07,74.55 | v18.8,67.44 v25.91,67.44
LFOOTPAD2  (via drill 0.41)
  Top 0.178: v10.29,69.6 14.1,65.79 R6.4 14.61,65.79 19.05,70.23 v20.45,70.23 | v8,69.47 6.22,71.25 2.92,71.25 2.92,71.75 XFOOTPAD.6 | v39.37,75.31 40.39,76.33 40.39,79.25 41.78,80.64 C25.1 | v24.77,74.04 U6.15 24.51,70.74 v23.75,69.98
  Bottom 0.178: v10.29,69.6 10.16,69.47 v8,69.47 | v39.37,75.31 37.85,73.79 25.02,73.79 v24.77,74.04 | v20.45,70.23 20.7,69.98 v23.75,69.98
LMIS  (via drill 0.41)
  Top 0.178: C12.1 15.75,84.45 15.75,81.92 R13.1 16.26,80.64 16.26,80.39 16.64,80.01 16.64,78.23 16.76,78.11 R17.2 17.91,76.96 v19.43,75.44 | v33.53,72.64 33.53,73.03 36.83,73.03 37.21,72.64 U10.15
  Bottom 0.178: v33.53,72.64 32.89,73.28 24.51,73.28 23.37,74.42 20.45,74.42 v19.43,75.44
LMISIN  (via drill 0.41)
  Top 0.178: v19.43,76.71 19.43,79.12 17.91,80.64 R13.2 | v21.21,75.18 21.21,64.64 17.4,60.83 13.72,60.83 13.72,55.75 12.32,54.36 v12.32,53.98 | v9.53,52.45 5.21,48.13 2.92,48.13 2.92,47.62 XPWM.12
  Bottom 0.178: v19.43,76.71 20.95,75.18 v21.21,75.18 | v12.32,53.98 10.79,52.45 v9.53,52.45
MCUXTAL1
  Top 0.178: U2.24 44.2,37.34 44.2,35.31 44.83,34.67 44.83,33.66 CX1.1 45.47,32.38 45.47,29.34 46.61,28.19 Q2.1
MCUXTAL2
  Top 0.178: 43.05,29.46 43.05,28.96 42.29,28.19 Q2.2 | 43.05,29.46 43.05,37.34 U2.23 | 43.05,29.46 40.51,32 40.51,32.26 40.39,32.38 CX2.1
N$1  (via drill 0.41)
  Top 0.178: v78.87,70.36 79.38,70.87 79.38,78.61 78.99,78.61 77.34,80.26 77.34,80.52 77.22,80.64 R19.1 | v73.41,65.02 72.01,63.63 72.01,63.25 IC2.3
  Bottom 0.178: v78.87,70.36 73.53,65.02 v73.41,65.02
N$2
  Top 0.178: OSC2.3 25.15,16 25.15,12.06 RO1.2
N$3  (via drill 0.41)
  Top 0.178: U11.7 54.61,83.06 53.98,82.42 53.98,78.11 C2.1 54.36,76.83 54.36,74.04 v59.05,74.04 | v64.9,73.03 64.77,72.9 64.77,69.85 64.39,69.47 64.39,67.06 IC4.3
  Bottom 0.178: v64.9,73.03 63.88,74.04 v59.05,74.04
N$4
  Top 0.178: U11.6 56.13,85.6 56.52,85.22 56.52,79.88 58.29,78.11 C1.1 59.44,76.83 59.44,76.58 59.82,76.2 59.82,70.36 62.23,67.94 62.23,64.52 64.64,64.52 64.77,64.64 64.77,67.31 65.15,67.69 65.15,70.1 IC4.5
N$5
  Top 0.178: R7.2 66.93,84.45 66.93,81.92 R8.2 66.29,80.64 66.29,80.39 65.91,80.01 65.91,78.23 65.79,78.11 R3.1 64.64,76.83 64.14,76.33 IC4.6
N$6
  Top 0.178: R10.1 70.87,78.11 70.99,78.23 70.99,80.01 71.37,80.39 71.37,80.64 R18.2 72.01,81.92 72.01,84.45 R15.2 71.37,85.72 71.37,87.12 65.28,87.12 64.14,85.98 64.14,84.96 63.5,84.33 63.5,67.44 63.12,67.06 IC4.2
N$7
  Top 0.178: UYAW.D1 57.15,19.18 55.5,19.18 55.5,18.16 CD20.2
N$8  (via drill 0.41)
  Top 0.178: v31.62,79.38 31.62,78.23 31.5,78.11 R21.1 | v45.59,86.87 53.59,86.87 53.59,87.25 53.85,87.5 80.77,87.5 80.77,70.99 81.15,70.61 81.15,68.07 v79.25,66.17 | v78.23,65.15 77.09,64.01 77.09,63.25 IC2.7 76.58,62.61 75.82,62.61 IC2.6
  Bottom 0.178: v31.62,79.38 32.26,80.01 38.73,80.01 v45.59,86.87 | v79.25,66.17 v78.23,65.15
N$9  (via drill 0.41)
  Top 0.178: v26.54,78.87 26.54,78.23 26.42,78.11 R22.1 | v73.79,74.04 75.31,74.04 75.31,72.77 IC2.11 75.82,72.14 76.58,72.14 IC2.10
  Bottom 0.178: v26.54,78.87 26.8,78.61 54.74,78.61 58.55,74.8 73.03,74.8 v73.79,74.04
N$10  (via drill 0.41)
  Top 0.178: v78.87,69.34 79.76,70.23 79.76,79.76 78.87,80.64 R19.2 | v73.41,64.01 73.28,63.88 73.28,63.25 IC2.4
  Bottom 0.178: v78.87,69.34 73.53,64.01 v73.41,64.01
N$11
  Top 0.178: C4.1 69.72,23.5 69.47,23.75 69.47,25.91 U3.1
N$12
  Top 0.178: C5.1 74.8,19.68 73.28,21.21 73.28,25.91 U3.4
N$13
  Top 0.178: R20.2 77.72,76.83 77.6,76.71 77.6,76.45 75.95,74.8 73.03,74.8 IC2.13
N$14
  Top 0.178: LED1.C 58.93,48.77 58.67,49.02 58.67,50.67 58.17,51.18 58.17,51.44 R11.1
N$15
  Top 0.178: R20.1 76.07,76.83 74.42,75.18 72.01,75.18 72.01,72.77 IC2.14
N$16
  Top 0.178: LED2.C 58.93,56.39 58.17,57.15 58.17,59.05 R12.1
N$17  (via drill 0.41)
  Top 0.178: v72.26,59.05 69.47,61.85 IC2.1
  Bottom 0.178: v72.26,59.05 74.17,60.96 XSG1.3
N$18  (via drill 0.41)
  Top 0.178: v73.41,59.18 70.74,61.85 IC2.2
  Bottom 0.178: v73.41,59.18 74.17,58.42 XSG1.2
N$19  (via drill 0.41)
  Top 0.178: v74.93,76.71 74.93,76.33 72.52,76.33 71.63,75.44 71.63,74.93 69.47,72.77 IC2.16
  Bottom 0.178: v74.93,76.71 77.98,73.66 XSG2.3
N$20
  Top 0.178: C5.2 76.45,19.68 76.33,19.81 76.33,20.07 74.68,21.72 74.3,21.72 U3.5
N$21  (via drill 0.41)
  Top 0.178: v73.41,70.61 71.5,70.61 70.74,71.37 IC2.15
  Bottom 0.178: v73.41,70.61 73.91,71.12 XSG2.2
N$22
  Top 0.178: C4.2 72.01,23.5 72.01,25.91 U3.3
N$23
  Top 0.178: UYAW.B7 62.23,21.08 63.88,22.73 63.88,24 C9.1
N$24  (via drill 0.41)
  Top 0.178: v70.36,21.46 70.36,19.68 C6.1 | v70.36,24.26 70.36,25.91 U3.2
  Bottom 0.178: v70.36,21.46 v70.36,24.26
N$25  (via drill 0.41)
  Top 0.178: v63.12,20.95 63.12,20.32 62.23,20.32 UYAW.C7 | v64.64,22.48 65.53,23.37 65.53,24 C9.2
  Bottom 0.178: v63.12,20.95 v64.64,22.48
N$26
  Top 0.178: C7.2 76.45,23.5 76.33,23.62 76.33,25.4 75.82,25.91 U3.6
N$27
  Top 0.178: UYAW.A5 60.58,21.84 60.58,24 C8.2
N$28
  Top 0.178: UYAW.A4 59.56,21.84 59.44,21.97 59.44,24 C8.1
N$29
  Top 0.178: UYAW.D7 62.23,19.43 63.88,19.43 63.88,20.45 C15.1
N$30
  Top 0.178: UYAW.C1 57.15,19.94 53.85,19.94 53.85,20.45 C22.1
N$33  (via drill 0.41)
  Top 0.178: v73.66,34.04 72.01,35.69 U3.14 | v81.41,29.21 81.79,28.83 81.79,22.48 83.69,20.57 85.98,20.57 85.98,20.07 SERIAL.5
  Bottom 0.178: v73.66,34.04 76.58,34.04 v81.41,29.21
N$34  (via drill 0.41)
  Top 0.178: v74.42,33.27 74.42,34.54 73.28,35.69 U3.13 | v83.69,28.45 87.5,28.45 87.5,18.29 86.74,17.53 SERIAL.3
  Bottom 0.178: v74.42,33.27 79.25,28.45 v83.69,28.45
N$35
  Top 0.178: U3.7 77.09,25.91 79.12,23.88 81.03,23.88 81.03,19.94 83.44,17.53 SERIAL.4
N$36
  Top 0.178: U3.8 78.36,25.91 79.12,25.15 79.12,24.77 79.63,24.26 81.41,24.26 81.41,22.1 83.44,20.07 SERIAL.6
OC1A  (via drill 0.41)
  Top 0.178: 36.45,31.11 35.81,30.48 34.92,30.48 34.92,30.1 U4.9 | 36.45,31.11 37.59,32.26 37.59,40.39 37.21,40.39 U2.15 | v51.31,67.18 51.31,69.09 49.15,71.25 R4.16 | v76.71,55.24 80.52,55.24 80.52,27.69 v80.64,27.69 | v37.72,29.72 36.45,30.99 36.45,31.11 | v30.99,27.3 30.99,28.19 U4.12
  Bottom 0.178: v51.31,67.18 56.26,62.23 68.07,62.23 74.42,55.88 76.07,55.88 v76.71,55.24 | v80.64,27.69 79.76,26.8 48.51,26.8 47.5,25.78 46.23,25.78 42.29,29.72 v37.72,29.72 37.34,29.59 34.42,26.67 31.62,26.67 v30.99,27.3
OC1B  (via drill 0.41)
  Top 0.178: 32.64,36.07 32.51,35.94 32.51,31.37 31.5,30.35 31.5,27.81 31.75,27.56 31.75,24.77 | 32.64,36.07 36.07,39.5 U2.16 | 31.75,24.77 31.75,24 31.88,23.88 U4.4 | v46.48,62.36 46.48,63.12 48.51,63.12 49.91,64.52 R4.2 | v35.43,61.85 35.43,50.04 v34.67,49.28 | v33.15,47.75 32.64,47.24 32.64,36.07 | 31.75,24.77 28.7,24.77 28.57,24.64 28.57,23.88 U4.1
  Bottom 0.178: v46.48,62.36 45.97,61.85 v35.43,61.85 | v33.15,47.75 v34.67,49.28
PB0  (via drill 0.41)
  Top 0.178: v33.4,40.51 33.4,44.32 36.07,44.32 U2.10 | v10.41,32.38 10.41,28.19 U8.4 11.94,27.69 12.45,27.18 12.45,23.24 13.34,22.35 13.34,19.81 12.06,18.54 12.06,11.81 11.94,11.68 U7.4
  Bottom 0.178: v33.4,40.51 32.51,39.62 13.72,39.62 10.41,36.32 v10.41,32.38
PB2  (via drill 0.41)
  Top 0.178: v34.16,43.05 36.07,43.05 U2.12 | v9.53,41.91 6.22,41.91 6.22,42.29 5.46,43.05 1.4,43.05 1.4,30.35 4.83,26.92 v6.35,26.92 | U8.7 9.91,24.38 9.91,24.51 v9.14,24.51 9.27,24.13 9.27,21.84 9.91,21.21 9.91,14.22 v11.3,12.83 | v12.7,11.43 12.7,8.64 11.94,7.87 U7.7
  Bottom 0.178: v34.16,43.05 33.15,42.04 9.65,42.04 v9.53,41.91 | v6.35,26.92 8.76,24.51 v9.14,24.51 | v12.7,11.43 v11.3,12.83
PB3  (via drill 0.41)
  Top 0.178: v34.16,42.04 36.07,42.04 U2.13 | v9.14,25.53 v9.14,34.29 | v13.46,18.92 12.95,18.41 12.95,14.22 U7.3
  Bottom 0.178: v34.16,42.04 33.78,41.66 14.48,41.66 8.76,35.94 8.76,34.29 v9.14,34.29 | v9.14,25.53 13.46,21.21 v13.46,18.92
PB4  (via drill 0.41)
  Top 0.178: v34.16,39.75 34.16,41.15 36.07,41.15 U2.14 | v12.32,37.08 13.08,36.32 13.08,30.86 12.95,30.73 U8.3
  Bottom 0.178: v34.16,39.75 33.66,39.24 13.97,39.24 12.32,37.59 v12.32,37.08
PITCH_RATE  (via drill 0.41)
  Top 0.178: v41.66,51.56 41.66,52.96 U2.60 | v66.93,39.75 66.04,38.86 66.04,32.13 59.94,26.04 v55.88,26.04 | v49.53,20.57 39.75,10.79 39.75,10.29 XPITCHGYRO.3
  Bottom 0.178: v41.66,51.56 43.81,49.4 55.37,49.4 63.25,41.53 66.67,41.53 67.18,41.02 67.18,39.75 v66.93,39.75 | v55.88,26.04 50.42,20.57 v49.53,20.57
PWMA  (via drill 0.41)
  Top 0.178: v25.78,32 26.8,30.99 26.8,30.23 26.67,30.1 26.67,21.59 28.83,21.59 28.96,21.72 28.96,24.38 30.1,24.38 30.61,23.88 U4.3
  Bottom 0.178: v25.78,32 25.78,31.62 16.51,31.62 15.88,32.26 11.3,32.26 10.67,31.62 9.4,31.62 6.86,34.16 5.71,34.16 XPWM.1
PWMB  (via drill 0.41)
  Top 0.178: v34.16,24.64 34.16,24.13 34.42,23.88 U4.6
  Bottom 0.178: v34.16,24.64 32.51,26.29 8,26.29 5.84,28.45 3.94,28.45 3.43,28.96 3.43,33.66 3.56,33.66 3.56,33.78 3.68,33.78 3.68,36.2 4.7,36.2 XPWM.3
PWMC  (via drill 0.41)
  Top 0.178: v34.16,27.43 34.92,27.43 35.69,28.19 U4.8 | v5.46,32.38 3.94,33.91 3.94,37.21 4.7,37.97 4.7,38.73 XPWM.5
  Bottom 0.178: v34.16,27.43 31.88,29.72 8.13,29.72 v5.46,32.38
PWMD  (via drill 0.41)
  Top 0.178: v32.51,27.43 32.51,28.07 32.38,28.19 U4.11 | v4.19,29.21 6.22,31.24 6.22,40.51 5.46,41.27 XPWM.7
  Bottom 0.178: v32.51,27.43 30.73,29.21 v4.19,29.21
R_PWM_ENABLE  (via drill 0.41)
  Top 0.178: v50.42,45.97 51.69,45.97 U2.41 | v61.47,67.69 59.44,69.72 59.44,73.03 52.07,73.03 51.69,72.64 R4.14 | v68.2,68.45 68.45,68.2 68.45,59.94 69.85,58.55 69.85,55.63 67.82,53.59 v67.82,50.93 | v60.83,46.99 58.29,46.99 58.29,49.02 58.04,49.28 56.26,49.28 v56.26,46.23 | XPWM.6 XPWM.8
  Bottom 0.178: XPWM.8 2.92,42.55 3.56,42.55 3.56,43.05 6.48,43.05 6.86,42.67 29.84,42.67 31.5,44.32 48.77,44.32 v50.42,45.97 50.8,46.1 56.13,46.1 v56.26,46.23 | v61.47,67.69 62.23,68.45 v68.2,68.45 | v67.82,50.93 63.88,46.99 v60.83,46.99
R_PWM_FWD  (via drill 0.41)
  Top 0.178: v52.7,34.42 53.21,34.92 53.21,42.8 52.83,42.8 U2.37 | v39.88,31.24 38.48,29.84 38.48,29.46 35.69,26.67 33.4,26.67 U4.10
  Bottom 0.178: v52.7,34.42 50.67,32.38 41.02,32.38 v39.88,31.24
R_PWM_REV  (via drill 0.41)
  Top 0.178: v54.36,36.45 54.74,36.83 54.74,37.72 54.1,38.35 54.1,43.56 52.83,43.56 U2.38 | v48.39,34.16 v50.93,36.7 | v31.75,34.16 29.84,32.26 29.84,30.1 U4.13
  Bottom 0.178: v54.36,36.45 54.1,36.7 v50.93,36.7 | v48.39,34.16 47.88,33.66 34.04,33.66 33.53,34.16 v31.75,34.16
RFOOTPAD1  (via drill 0.41)
  Top 0.178: v19.68,68.2 18.29,68.2 15.88,65.79 R6.5 | v25.91,69.22 25.91,70.74 U6.14 26.29,72.64 26.29,75.31 v27.05,76.07 | v33.91,77.85 33.91,81.66 36.7,84.45 C24.1 | v8,68.45 4.95,68.45 3.94,69.47 3.17,69.47 XFOOTPAD.4
  Bottom 0.178: v25.91,69.22 20.7,69.22 v19.68,68.2 19.3,68.33 8.13,68.33 v8,68.45 | v33.91,77.85 33.66,77.6 28.57,77.6 v27.05,76.07
RFOOTPAD2  (via drill 0.41)
  Top 0.178: v40.39,75.31 40.39,75.44 41.78,76.83 C26.1 | v28.83,76.83 28.83,72.64 U6.12 | v9.53,70.36 9.53,69.09 12.83,65.79 R6.3 | v8.51,71.37 6.1,73.79 2.92,73.79 2.92,74.3 XFOOTPAD.8
  Bottom 0.178: v40.39,75.31 38.86,76.83 v28.83,76.83 27.3,75.31 22.23,75.31 20.07,77.47 16.26,77.47 9.53,70.74 v9.53,70.36 v8.51,71.37
RIGHT_ACCEL  (via drill 0.41)
  Top 0.178: v53.59,74.17 49.53,74.17 48.13,72.77 48.13,66.67 45.72,64.26 45.72,58.8 44.2,57.28 44.2,54.1 U2.57 | v60.58,73.28 62.61,73.28 62.61,72.26 IC4.7 | v67.18,74.04 67.18,76.83 R3.2
  Bottom 0.178: v53.59,74.17 54.48,73.28 v60.58,73.28 60.96,73.15 61.85,72.26 65.41,72.26 v67.18,74.04
RMIS
  Top 0.178: R16.2 21.84,78.11 21.72,78.23 21.72,80.01 21.34,80.39 21.34,80.64 R9.1 20.83,81.92 20.83,84.45 C13.1 21.34,85.72 21.34,86.87 44.2,86.87 45.09,85.98 45.09,76.2 41.53,72.64 U10.12
RMISIN  (via drill 0.41)
  Top 0.178: v23.5,73.28 23.5,80.14 22.99,80.64 R9.2 | v20.45,71.25 v20.45,73.41 | v19.68,69.47 20.45,68.71 20.45,64.52 17.14,61.21 11.05,61.21 11.05,59.82 6.22,54.99 6.22,50.93 5.46,50.16 XPWM.13
  Bottom 0.178: v23.5,73.28 23.37,73.41 v20.45,73.41 | v20.45,71.25 19.68,70.48 v19.68,69.47
ROLL_RATE  (via drill 0.41)
  Top 0.178: v43.18,40.64 43.18,52.96 U2.58 | v9.53,35.69 8.38,34.54 8.38,16.13 9.53,14.99 9.53,7.11 9.65,6.99 13.21,6.99 13.21,5.97 13.34,5.84 13.34,3.3 14.61,2.03 54.74,2.03 v54.74,5.33
  Bottom 0.178: v43.18,40.64 42.8,41.02 34.92,41.02 34.67,41.27 14.73,41.27 9.53,36.07 v9.53,35.69 | v54.74,5.33 55.75,6.35 55.75,7.49 XROLLGYRO.3
RXD0  (via drill 0.41)
  Top 0.178: v40.01,43.56 40.01,50.8 37.21,50.8 U2.2 | v57.15,39.24 60.58,35.81 60.58,34.92 PROG.4 | v69.09,32.51 74.68,32.51 75.18,33.02 75.18,35.05 74.55,35.69 U3.12
  Bottom 0.178: v40.01,43.56 41.4,42.16 55.12,42.16 57.15,40.13 v57.15,39.24 | v69.09,32.51 66.17,35.43 61.59,35.43 61.59,34.92 61.34,34.92 PROG.4
RXD1  (via drill 0.41)
  Top 0.178: v46.48,36.7 46.48,37.34 U2.27 | v69.85,38.23 74.17,38.23 74.42,37.97 77.85,37.97 77.85,37.59 U3.9
  Bottom 0.178: v46.48,36.7 48.13,38.35 48.13,40.01 52.83,40.01 56.77,36.07 67.69,36.07 v69.85,38.23
SCK  (via drill 0.41)
  Top 0.178: v38.48,45.09 38.48,43.94 37.21,43.94 U2.11 | v57.78,45.97 61.21,45.97 61.21,37.72 62.1,36.83 62.1,33.53 61.34,32.77 61.34,32.38 PROG.3
  Bottom 0.178: v38.48,45.09 40.13,46.74 55.75,46.74 56.01,46.99 56.77,46.99 v57.78,45.97
SG1  (via drill 0.41)
  Top 0.178: C19.1 31.5,84.45 31.62,84.33 31.62,82.55 32,82.17 32,81.92 R23.2 32.64,80.64 32.64,78.11 R21.2 33.15,76.83 33.15,76.58 v34.29,75.44 | v36.2,75.31 38.23,75.31 40.64,72.9 40.64,70.36 41.02,69.98 41.02,66.42 U10.5
  Bottom 0.178: v36.2,75.31 36.07,75.44 v34.29,75.44
SG2  (via drill 0.41)
  Top 0.178: 27.56,79.12 27.56,80.64 R24.2 26.92,81.92 26.92,82.17 26.54,82.55 26.54,84.33 26.42,84.45 C20.1 | 27.56,79.12 27.56,78.11 R22.2 | v35.43,74.55 36.45,74.55 38.1,72.9 38.1,70.36 37.47,69.72 U10.2 | v33.53,74.68 29.59,74.68 29.59,77.09 27.56,79.12
  Bottom 0.178: v35.43,74.55 35.31,74.68 v33.53,74.68
SGPWR  (via drill 0.41)
  Top 0.178: v69.6,53.72 69.6,53.21 69.47,53.09 IC3.1 | v75.18,54.74 76.33,55.88 CD13.+ 78.61,58.29 80.52,60.2 80.52,63.88 | 80.52,63.88 78.11,66.29 IC2.9 | 82.93,63.88 83.31,63.88 XSG1.4 | 80.52,63.88 82.93,63.88 | 82.93,63.88 82.93,74.42 83.82,75.31 XSG2.4
  Bottom 0.178: v69.6,53.72 70.61,54.74 v75.18,54.74
TEMPA  (via drill 0.41)
  Top 0.178: v43.31,67.18 44.58,67.18 46.1,68.71 46.1,79.88 46.86,80.64 C27.1 | v24,63.88 23.75,64.14 23.75,64.52 U6.1 | v9.53,62.36 9.53,59.31 5.46,55.24 XPWM.17
  Bottom 0.178: v43.31,67.18 40.01,63.88 v24,63.88 23.62,63.75 10.92,63.75 v9.53,62.36
TEMPB  (via drill 0.41)
  Top 0.178: C28.1 36.7,76.83 32.89,73.03 29.21,73.03 29.21,69.34 28.96,69.09 28.96,66.55 28.83,66.42 U6.5 28.83,64.52 30.86,62.48 30.86,56.77 v18.54,56.77 | v8,59.56 5.97,59.56 3.94,57.53 3.94,56.26 2.92,55.24 XPWM.18
  Bottom 0.178: v8,59.56 9.53,58.04 17.27,58.04 v18.54,56.77
TEMPC  (via drill 0.41)
  Top 0.178: v34.67,80.77 36.7,80.77 C29.1 | v26.8,79.88 24.77,79.88 24.77,75.06 25.53,74.3 25.53,73.03 25.4,72.9 25.4,69.72 25.02,69.34 25.02,66.42 U6.2 24.77,63.63 22.99,61.85 22.99,57.78 18.54,57.78 18.03,57.28 v16.38,57.28
  Bottom 0.178: v34.67,80.77 34.29,80.39 27.3,80.39 v26.8,79.88 | v16.38,57.28 5.71,57.28 XPWM.19
TEMPD  (via drill 0.41)
  Top 0.178: v42.8,68.71 44.45,70.36 44.45,72.9 45.47,73.91 45.47,83.06 46.86,84.45 C30.1 | v28.19,67.94 27.56,67.31 27.56,66.42 U6.4 | v8,62.74 8,62.61 XPWM.20
  Bottom 0.178: v42.8,68.71 42.55,68.45 31.75,68.45 31.24,67.94 v28.19,67.94 27.81,67.82 26.67,66.67 11.94,66.67 v8,62.74
TXD0  (via drill 0.41)
  Top 0.178: v40.01,42.55 39.24,43.31 39.24,50.16 37.21,50.16 U2.3 | v54.86,41.4 55.37,40.89 55.37,33.15 v56.01,32.51 | v69.09,31.5 74.3,31.5 75.56,32.77 U3.11 | v64.9,32.89 62.1,32.89 62.1,31.37 61.34,30.61 58.8,30.61 58.8,31.11 PROG.1
  Bottom 0.178: v40.01,42.55 41.15,41.4 v54.86,41.4 | v56.01,32.51 56.64,31.88 57.78,31.88 PROG.1 | v69.09,31.5 67.69,32.89 v64.9,32.89
TXD1  (via drill 0.41)
  Top 0.178: v49.53,30.86 48.9,31.5 48.9,32.64 47.37,34.16 47.37,37.34 U2.28 | v69.09,29.59 75.56,29.59 75.56,32.13 76.58,33.15 76.58,35.69 U3.10
  Bottom 0.178: v49.53,30.86 50.8,29.59 v69.09,29.59
VBATSENSE
  Top 0.178: R6.16 10.41,72.52 10.41,73.41 7.75,76.07 1.4,76.07 1.4,53.47 2.16,52.7 XPWM.16
VCC  (via drill 0.41)
  Top 0.406: R6.12 15.88,71.88 16.64,71.88 R6.11 | 15.75,74.55 15.75,72.52 R6.12 | 15.75,74.55 15.75,76.83 R17.1 | R14.1 11.18,76.83 11.18,74.3 12.83,72.64 12.83,72.52 R6.14 13.34,71.88 14.1,71.88 R6.13 14.61,71.88 15.37,71.88 R6.12 | 15.75,74.55 20.32,74.55 20.32,76.83 R16.1 21.34,76.83 21.34,76.33 22.61,75.06 22.61,72.9 23.24,72.26 U6.16 23.24,70.74 22.48,69.98 22.48,60.2 22.35,60.07 LAVCC1.1 21.46,59.31 20.83,59.31 19.94,58.42 17.53,58.42 17.53,59.05 CD16.1 16.38,59.05 15.49,58.17 15.49,55.5 14.73,54.74 14.73,36.2 14.61,36.07 | 14.61,36.07 12.57,38.1 CD1.+ 10.29,38.1 7.87,35.69 7.87,27.18 5.46,24.77 XENC.9 4.7,23.5 3.81,22.61 3.81,18.03 2.92,17.14 XENC.4 2.92,15.88 3.81,14.99 3.81,9.91 8.26,5.46 8.26,5.33 10.79,2.79 v12.83,2.79 | 14.61,36.07 16.51,34.16 U8.20 | UYAW.A3 58.8,21.84 58.8,22.1 56.9,24 55.5,24 C18.2 54.99,25.27 54.99,27.56 | CD12.1 57.02,43.81 56.26,43.05 56.26,38.86 58.04,37.08 58.04,34.92 PROG.2 58.04,33.66 58.04,33.27 54.99,30.23 54.99,27.56 | 44.45,11.43 45.85,10.03 50.16,10.03 XROLLGYRO.1 | 44.45,11.43 44.2,11.68 44.2,12.06 CD18.1 | 50.42,28.45 50.42,10.29 XROLLGYRO.1 | 50.42,28.45 50.42,32.38 CD11.1 | v53.98,27.56 54.99,27.56 | 50.42,28.45 v52.83,28.45 | v41.66,36.58 41.66,37.34 U2.21 | v36.83,36.45 35.31,34.92 35.31,33.66 CD7.1 | CD4.1 23.37,27.3 23.37,24.77 CD17.1 22.73,23.5 22.48,23.24 22.48,17.53 22.99,17.02 OSC2.1 23.24,16 23.24,12.06 RO1.1 23.75,10.79 23.75,9.02 23.88,8.89 | U4.14 28.07,30.1 27.3,30.86 27.3,31.75 26.04,33.02 IC1.3 25.27,32.77 24.89,32.38 24.89,31.37 26.16,30.1 26.16,21.34 35.94,11.56 38.1,11.56 38.1,6.86
  Top 0.406: 23.37,5.33 23.37,6.99 CD6.1 23.88,8.26 23.88,8.89 | 23.37,5.33 23.37,4.45 CD10.1 | v17.27,6.86 16.64,7.49 16.64,12.19 U7.20 | v18.8,5.33 23.37,5.33 | 23.88,8.89 XPITCHGYRO.1 34.67,7.49 34.67,6.86 38.1,6.86 | 38.1,6.86 39.88,6.86 44.45,11.43 | U10.16 36.07,70.74 36.07,70.61 35.43,69.98 35.43,64.26 36.7,62.99 36.7,60.33 CD3.1 37.85,59.05 37.85,58.67 v39.12,57.4 | 47.62,57.91 48.01,57.53 48.01,54.1 U2.52 | 47.62,57.91 47.62,59.05 CD2.1 48.01,60.33 48.01,61.21 51.18,64.39 51.18,64.52 R4.3 | R4.3 51.69,64.52 51.94,64.26 51.94,60.33 CD15.1 | R4.3 51.69,65.91 51.69,66.04 52.2,66.55 52.2,70.99 52.45,71.25 R4.13 52.96,71.25 52.96,70.74 v58.67,70.74 | v60.58,70.87 61.34,70.87 IC4.8 | v46.86,57.4 47.5,58.04 47.62,57.91 | SERIAL.8 83.44,22.61 82.3,23.75 82.3,42.04 83.82,43.56 XDASH.5 86.36,45.34 87.38,46.35 87.38,47.62 86.36,48.64 XDASH.7 | UYAW.E7 62.23,18.41 63.88,18.41 CD21.1 63.88,17.14 62.1,15.37 | 62.1,15.37 61.47,14.73 61.47,13.34 CD5.1 | 71.37,17.78 71.37,13.97 67.69,10.29 XYAWGYRO.1 66.93,10.29 66.93,10.54 62.1,15.37 | 71.37,17.78 71.37,18.41 C6.2 | 74.3,67.18 IC2.5 R1.12 | 74.3,67.18 IC2.12 | R1.12 74.04,47.88 73.28,47.88 R1.13 72.77,47.12 72.77,46.61 71.12,46.61 68.2,43.69 68.2,38.35 68.96,37.59 U3.16 68.96,35.69 68.2,34.92 68.2,17.78 71.37,17.78 | R1.12 74.55,47.88 75.31,47.88 R1.11 75.82,47.12 75.82,44.58 v79.12,44.58 | v68.2,70.74 70.61,70.74 74.17,67.18 74.3,67.18 | v66.93,6.22 52.2,6.22 51.69,6.73 51.69,6.99 51.18,7.49 XROLLGYRO.1
  Bottom 0.406: v53.98,27.56 53.09,28.45 v52.83,28.45 | v41.66,36.58 41.53,36.45 v36.83,36.45 36.45,36.32 35.18,35.05 26.29,35.05 IC1.3 | v18.8,5.33 v17.27,6.86 16.89,6.73 16.76,6.73 v12.83,2.79 | v58.67,70.74 60.45,70.74 v60.58,70.87 60.96,70.74 v68.2,70.74 | v46.86,57.4 v39.12,57.4 | v79.12,44.58 83.31,44.58 XDASH.5 | v66.93,6.22 66.93,7.49 XYAWGYRO.1
YAW_RATE  (via drill 0.41)
  Top 0.178: UYAW.B1 57.15,20.95 55.5,20.95 C22.2 54.36,21.72 54.36,22.23 53.72,22.23 52.2,23.75 | v48.9,39.24 48.9,38.86 43.18,38.86 42.42,39.62 42.42,52.96 U2.59 | v53.98,37.47 53.59,37.08 53.59,28.19 53.21,27.81 53.21,26.92 52.2,25.91 52.2,23.75 | 52.2,23.75 52.2,6.99 70.23,6.99 70.99,7.75 71.75,7.75 XYAWGYRO.3
  Bottom 0.178: v48.9,39.24 50.67,37.47 v53.98,37.47
(copper drawn outside any net)
  shapes: Top area x1